# Altium schematic sheet main.SchDoc
size A4
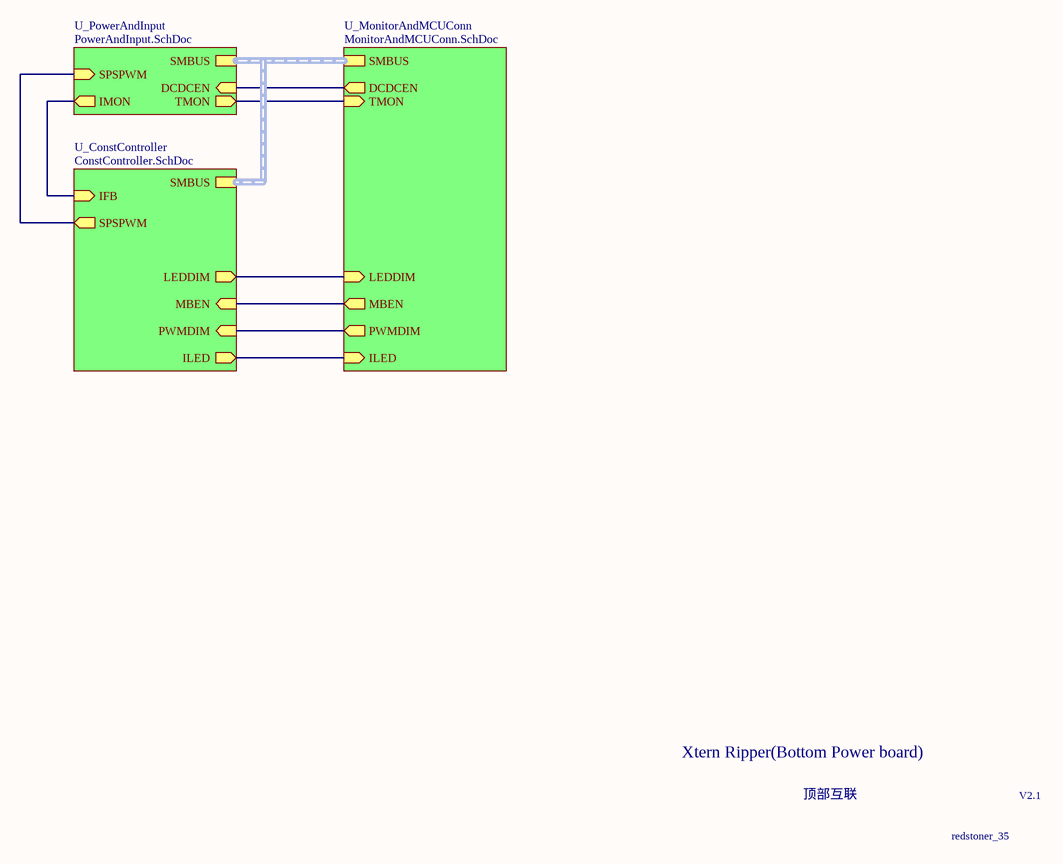
[diagram p0: main.SchDoc]

## Sub-sheets
U_ConstController = ConstController.SchDoc: IFB (in), SPSPWM (out), SMBUS (harness SMBUS), PWMDIM (in), MBEN (in), ILED (out), LEDDIM (out)
U_MonitorAndMCUConn = MonitorAndMCUConn.SchDoc: SMBUS (harness SMBUS), PWMDIM (out), DCDCEN (out), MBEN (out), ILED (in), LEDDIM (in), TMON (in)
U_PowerAndInput = PowerAndInput.SchDoc: SMBUS (harness SMBUS), DCDCEN (in), TMON (out), IMON (out), SPSPWM (in)

## Nets
(unnamed): sheet U_ConstController/IFB, sheet U_PowerAndInput/IMON
(unnamed): sheet U_ConstController/SPSPWM, sheet U_PowerAndInput/SPSPWM
(unnamed): sheet U_ConstController/PWMDIM, sheet U_MonitorAndMCUConn/PWMDIM
(unnamed): sheet U_ConstController/MBEN, sheet U_MonitorAndMCUConn/MBEN
(unnamed): sheet U_ConstController/ILED, sheet U_MonitorAndMCUConn/ILED
(unnamed): sheet U_ConstController/LEDDIM, sheet U_MonitorAndMCUConn/LEDDIM
(unnamed): sheet U_MonitorAndMCUConn/DCDCEN, sheet U_PowerAndInput/DCDCEN
(unnamed): sheet U_MonitorAndMCUConn/TMON, sheet U_PowerAndInput/TMON

## Buses and harness runs
harness sheet U_ConstController/SMBUS = sheet U_MonitorAndMCUConn/SMBUS = sheet U_PowerAndInput/SMBUS

## Notes on the sheet
- Xtern Ripper(Bottom Power board)
- 顶部互联
- V2.1
- redstoner_35